# Altium schematic sheet BUCK.SchDoc
size B; Organization: Altium Limited; Address1: L3, 12a Rodborough Rd; Address2: Frenchs Forest; Address3: NSW; Address4: Australia 2086
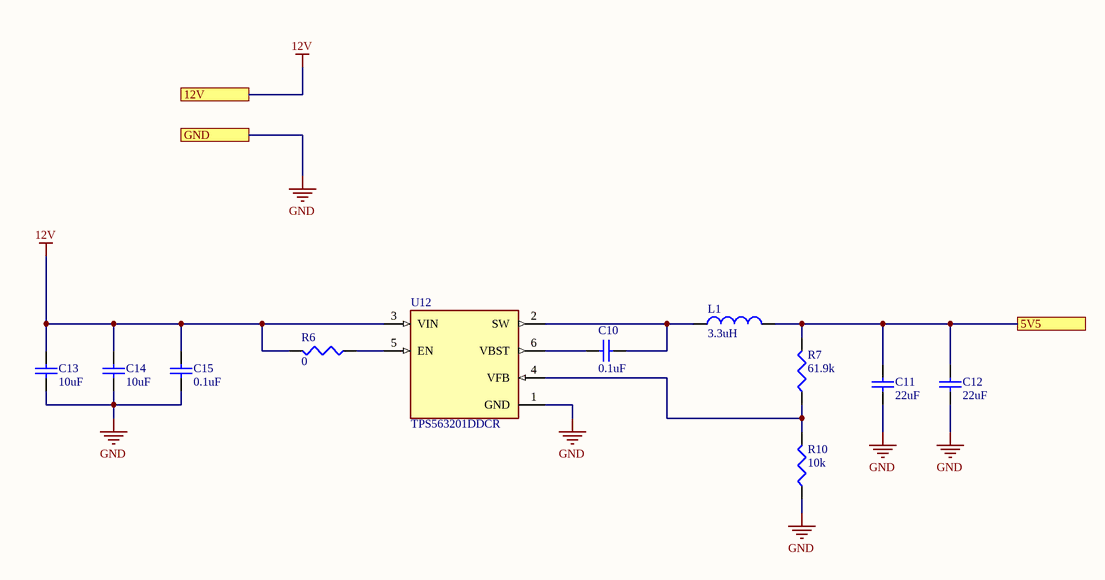
[diagram p0: BUCK.SchDoc]

## Parts
C10  0.1uF  [SMD-0603]
C11  22uF  [SMD-0805]
C12  22uF  [SMD-0805]
C13  10uF  [SMD-1206]
C14  10uF  [SMD-1206]
C15  0.1uF  [SMD-0603]
L1  3.3uH  [SMD-2525]
R6  0  [SMD-0603]
R7  61.9k  [SMD-0603]
R10  10k  [SMD-0603]
U12  TPS563201DDCR  [SOT95P280X110-6N]

## Ports
5V5, 12V, GND

## Nets
12V: C13.2 C14.2 C15.2 R6.2 U12.3(VIN) ; port 12V
GND: C11.1 C12.1 C13.1 C14.1 C15.1 R10.1 U12.1(GND) ; port GND
5V5: C11.2 C12.2 L1.2 R7.2 ; port 5V5
NetC10_1: C10.1 U12.6(VBST)
NetC10_2: C10.2 L1.1 U12.2(SW)
NetR6_1: R6.1 U12.5(EN)
NetR7_1: R7.1 R10.2 U12.4(VFB)

## Notes on the sheet
- Title
- Size:
- Date:
- B
- Number:
- Time:
- Revision:
- Sheet
- of
- File:

## Library data of the parts
C10 = CAP0603: Ceramic Capacitor 0603
C11 C12 = CAP0805: Ceramic Capacitor 0805 Imperial (2012 Metric)
C13 C14 = CAP1206_HV: Ceramic Capacitor 1206 Imperial, 25V
C15 = CAP0603_HV: Ceramic Capacitor 0603, 25V
L1 = VLS6045EX: VLS6045EX type Inductor 2525
R6 R7 R10 = RES0603: Resistor-0603
U12 = TPS563201DDCR: 4.5 V to 17 V input, 3 A output, synchronous step-down converter in Eco-mode; MF: Texas Instruments; Value: *; Availability: In Stock; Check_prices: https://www.snapeda.com/parts/TPS563201DDCR/Texas+Instruments/view-part/?ref=eda; Price: None; SnapEDA_Link: https://www.snapeda.com/parts/TPS563201DDCR/Texas+Instruments/view-part/?ref=snap; Purchase-URL: https://pricing.snapeda.com/search/part/TPS563201DDCR/?ref=eda; Package: SOT-23-THN-6 Texas Instruments; MP: TPS563201DDCR